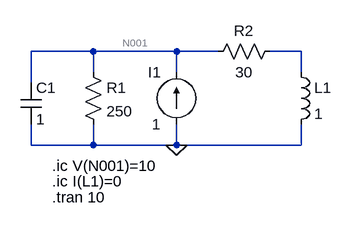
[diagram p0: schematic example1.asc]
example1.asc, the LTspice schematic file:
Version 4
SHEET 1 880 680
WIRE 112 96 16 96
WIRE 240 96 112 96
WIRE 304 96 240 96
WIRE 432 96 384 96
WIRE 112 128 112 96
WIRE 240 128 240 96
WIRE 432 128 432 96
WIRE 16 144 16 96
WIRE 16 240 16 208
WIRE 112 240 112 208
WIRE 112 240 16 240
WIRE 240 240 240 208
WIRE 240 240 112 240
WIRE 432 240 432 208
WIRE 432 240 240 240
FLAG 240 240 0
SYMBOL cap 0 144 R0
SYMATTR InstName C1
SYMATTR Value 1
SYMBOL res 96 112 R0
SYMATTR InstName R1
SYMATTR Value 250
SYMBOL current 240 208 R180
WINDOW 0 24 80 Left 2
WINDOW 3 24 0 Left 2
WINDOW 123 0 0 Left 0
WINDOW 39 0 0 Left 0
SYMATTR InstName I1
SYMATTR Value 1
SYMBOL res 400 80 R90
WINDOW 0 0 56 VBottom 2
WINDOW 3 32 56 VTop 2
SYMATTR InstName R2
SYMATTR Value 30
SYMBOL ind 416 112 R0
SYMATTR InstName L1
SYMATTR Value 1
TEXT 48 272 Left 2 !.ic V(N001)=10
TEXT 48 296 Left 2 !.ic I(L1)=0
TEXT 48 320 Left 2 !.tran 10

The netlist it stands for:
* example1.asc
C1 N001 0 1
R1 N001 0 250
I1 0 N001 1
R2 N002 N001 30
L1 N002 0 1
.ic V(N001)=10
.ic I(L1)=0
.tran 10
.backanno
.end